# Altium project esp-node.PrjPcb
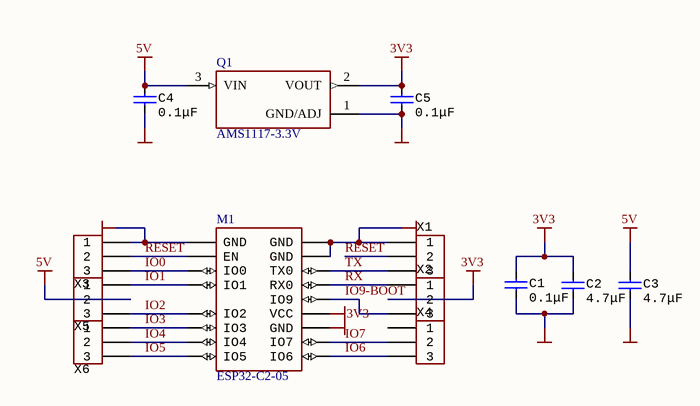
[diagram p0: esp-node.SchDoc]
1 sheet, 13 parts. Net scope: global (net labels, ports and power ports of the same name join across sheets).
Board file: esp-node.PcbDoc

## Sheet esp-node.SchDoc
size A; SheetNumber: 1; SheetTotal: 1

### Parts
C1  value 0.1μF  [CAP: 0603]  (hidden comment: CL10B104KC8NNNC)
C2  value 4.7μF  [CAP: 0603]  (hidden comment: CL10B475KQ8NQNC)
C3  value 4.7μF  [CAP: 0603]  (hidden comment: CL10B475KQ8NQNC)
C4  value 0.1μF  [CAP: 0603]  (hidden comment: CL10B104KC8NNNC)
C5  value 0.1μF  [CAP: 0603]  (hidden comment: CL10B104KC8NNNC)
M1  ESP32-C2-05  [ESP32-C2-05]
Q1  AMS1117-3.3V  [SOT223]
X1  PMbus  [CON: PLS-3]  (value not drawn)
X2  PMbus  [CON: PLS-3]  (value not drawn)
X3  PMbus  [CON: PLS-3]  (value not drawn)
X4  PMbus  [CON: PLS-3]  (value not drawn)
X5  PMbus  [CON: PLS-3]  (value not drawn)
X6  PMbus  [CON: PLS-3]  (value not drawn)

### Nets
3V3: C1.1 C2.1 C5.1 M1.12(VCC) Q1.2(VOUT) X2.2
5V: C3.1 C4.1 Q1.3(VIN) X5.2
GND: C1.2 C2.2 C3.2 C4.2 C5.2 M1.1(GND) M1.11(GND) M1.16(GND) M1.17(GND) Q1.1(GND/ADJ) X1.1 X3.1
IO0: M1.3(IO0) X3.3
IO1: M1.4(IO1) X5.1
IO2: M1.5(IO2) X5.3
IO3: M1.6(IO3) X6.1
IO4: M1.7(IO4) X6.2
IO5: M1.8(IO5) X6.3
IO6: M1.9(IO6) X4.3
IO7: M1.10(IO7) X4.2
IO9-BOOT: M1.13(IO9) X2.3
RESET: M1.2(EN) X1.2 X3.2
RX: M1.14(RX0) X2.1
TX: M1.15(TX0) X1.3

Not connected (* = marked no-connect by the designer): X4 1

### Library data of the parts
C1 C4 C5 = CL10B104KC8NNNC: 0.1uF, 100V, 0603, X7R, ±10%, -55...+125°C; Manufacturer: Samsung; Package: 0603; HelpURL: https://www.mouser.com/ProductDetail/Samsung-Electro-Mechanics/CL10B104KC8NNNC?qs=%2FukktrhNKsY5bKXvqblW4Q%3D%3D; PartNumber: CL10B104KC8NNNC; Manufacturer Part Number: CL10B104KC8NNNC; Component Type: Capacitors
C2 C3 = CL10B475KQ8NQNC: 4.7uF, 6.3V, 0603, X7R, ±20%, -55...+85°C; Manufacturer: Samsung; Package: 0603; PartNumber: CL10B475KQ8NQNC; HelpURL: https://eu.mouser.com/ProductDetail/Samsung-Electro-Mechanics/CL10B475KQ8NQNC?qs=6tbHoouHnQxd6rcaSwpT7Q%3D%3D; Manufacturer Part Number: CL10B475KQ8NQNC; Component Type: Capacitors
X1-X6 = PLS-3: 3 pins, pitch 2.54 mm, 500VAC, 2A/pin, -40...+85°C; Manufacturer: Connfly; Pitch: 2.54mm; PartNumber: PLS-3; HelpURL: https://www.chipdip.ru/product/pls-3; Manufacturer Part Number: PLS-3; Component Type: Connectors